# EAGLE design DualDCMotor v1-0 (EAGLE 6.5.0)
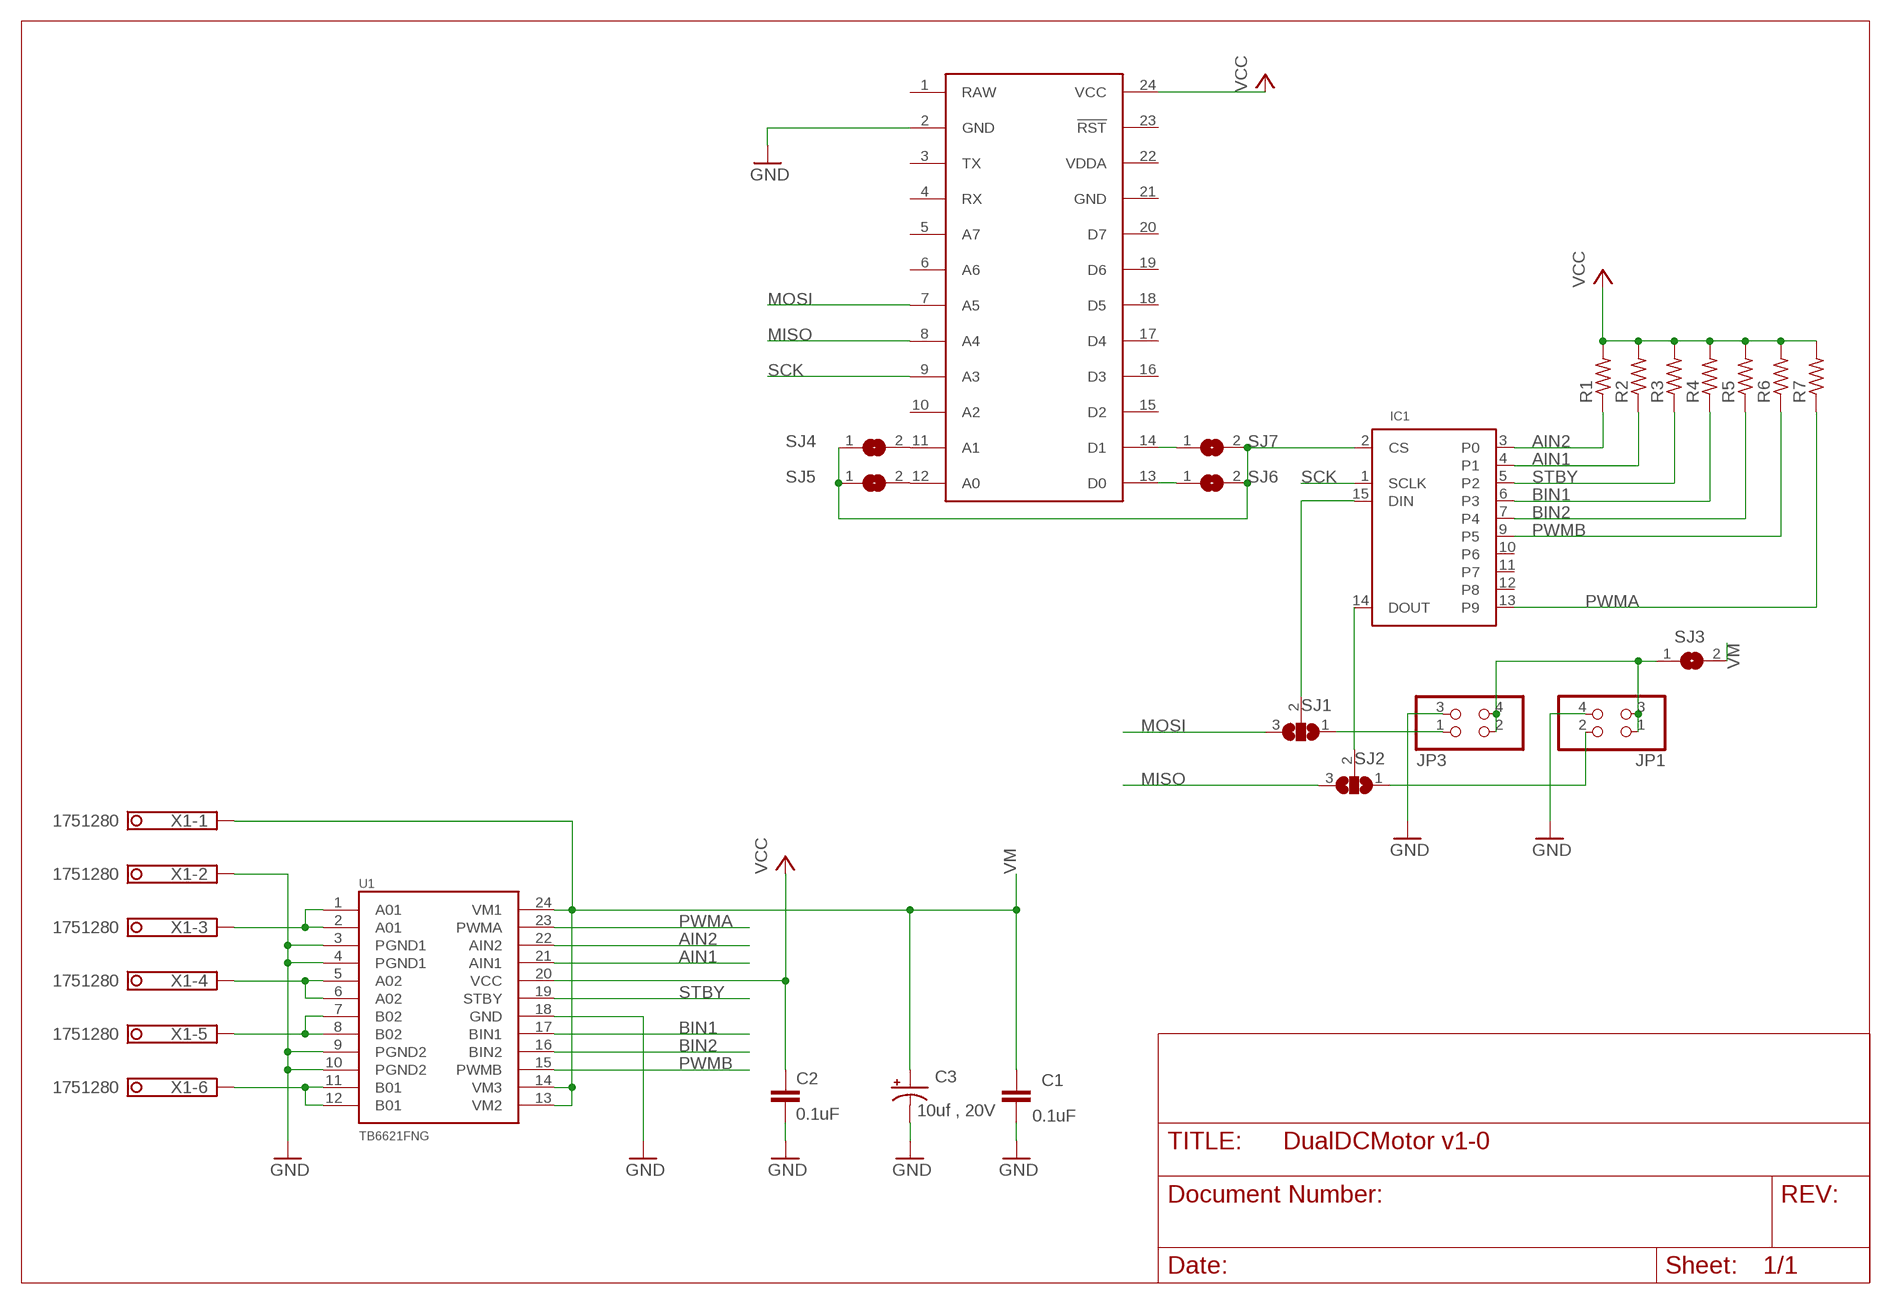
[diagram p0: schematic, sheet 1]

## Parts
C1  0.1uF  CAP0402-CAP  [0402-CAP]
C2  0.1uF  CAP0402-CAP  [0402-CAP]
C3  10uf , 20V  CAP_POL3528  [EIA3528]
IC1  MAX6966AEE  [QSOP16]
JP1  PINHD-2X02_2.54-SMD  [2X02SMD]
JP3  PINHD-2X02_2.54-SMD  [2X02SMD]
R1  R-US_R0603  [R0603]
R2  R-US_R0603  [R0603]
R3  R-US_R0603  [R0603]
R4  R-US_R0603  [R0603]
R5  R-US_R0603  [R0603]
R6  R-US_R0603  [R0603]
R7  R-US_R0603  [R0603]
SJ1  SJ2W  [SJ_2]
SJ2  SJ2W  [SJ_2]
SJ3  SJW  [SJW]
SJ4  SJ  [SJ]
SJ5  SJ  [SJ]
SJ6  SJ  [SJ]
SJ7  SJ  [SJ]
U1  TB6621FNG  [SSOP24]
U$1  SPARK_CORECORE  [SPARK_CORE]
X1  1751280  [1751280]

## Nets
A01: U1.1(A01) U1.2(A01) X1.3
A02: U1.5(A02) U1.6(A02) X1.4
AIN1: IC1.4(P1) R2.1 U1.21(AIN1)
AIN2: IC1.3(P0) R1.1 U1.22(AIN2)
B01: U1.11(B01) U1.12(B01) X1.6
B02: U1.7(B02) U1.8(B02) X1.5
BIN1: IC1.6(P3) R4.1 U1.17(BIN1)
BIN2: IC1.7(P4) R5.1 U1.16(BIN2)
GND: C1.2 C2.2 C3.C(-) JP1.4 JP3.3 U1.3(PGND1) U1.4(PGND1) U1.9(PGND2) U1.10(PGND2) U1.18(GND) U$1.2(GND) X1.2
MISO: SJ2.3 U$1.8(A4)
MOSI: SJ1.3 U$1.7(A5)
N$1: JP3.1 SJ1.1
N$2: JP1.2 SJ2.1
N$3: IC1.15(DIN) SJ1.2
N$4: IC1.14(DOUT) SJ2.2
N$6: SJ4.2 U$1.11(A1)
N$7: SJ5.2 U$1.12(A0)
N$8: SJ6.1 U$1.13(D0)
N$9: SJ7.1 U$1.14(D1)
N$15: IC1.2(CS) SJ4.1 SJ5.1 SJ6.2 SJ7.2
PWMA: IC1.13(P9) R7.1 U1.23(PWMA)
PWMB: IC1.9(P5) R6.1 U1.15(PWMB)
SCK: IC1.1(SCLK) U$1.9(A3)
STBY: IC1.5(P2) R3.1 U1.19(STBY)
VCC: C2.1 R1.2 R2.2 R3.2 R4.2 R5.2 R6.2 R7.2 U1.20(VCC) U$1.24(VCC)
VM: C1.1 C3.A(+) SJ3.2 U1.13(VM2) U1.14(VM3) U1.24(VM1) X1.1
VM2: JP1.1 JP1.3 JP3.2 JP3.4 SJ3.1
Unconnected: IC1.10(P6) IC1.11(P7) IC1.12(P8) U$1.3(TX) U$1.4(RX) U$1.5(A7) U$1.6(A6) U$1.10(A2) U$1.15(D2) U$1.16(D3) U$1.17(D4) U$1.18(D5) U$1.19(D6) U$1.20(D7) U$1.23(!RST)

## Power pins joined to a net without a drawn wire
GND: IC1.8(GND) U$1.21(GND)
RAW: U$1.1(RAW)
VCC: IC1.16(VCC)
VDDA: U$1.22(VDDA)

## Library data of the parts
C1 C2 = SparkFun:CAP: Capacitor Standard 0603 ceramic capacitor, and 0.1" leaded capacitor.
C3 = SparkFun:CAP_POL: Capacitor Polarized These are standard SMD and PTH capacitors. Normally 10uF, 47uF, and 100uF in electrolytic and tantalum varieties. Always verify the external diameter of the through hole cap, it varies with capacity, voltage, and manufacturer. The EIA devices should be standard.
IC1 = max696x:MAX6966AEE
JP1 JP3 = pinhead-2:PINHD-2X02: PIN HEADER
R1-R7 = resistor:R-US_: RESISTOR, American symbol
SJ1 SJ2 = jumper:SJ2W: SMD solder JUMPER
SJ3-SJ7 = jumper:SJ: SMD solder JUMPER
U1 = SparkFun:TB6621FNG: Toshiba 1A motor driver
U$1 = Spark:SPARK_CORE
X1 = con-phoenix-350:1751280: MKDS 1/ 6-3,5 Printklemme Nennstrom: 10 A Bemessungsspannung: 160 V Raster: 3,5 mm Polzahl: 6 Montageart: Löten Anschlussart: Schraubanschluss Anschlussrichtung vom Leiter zur Platine: 0° Source: http://eshop.phoenixcontact.com .. 1751280.pdf; MPN: 1751280; OC_FARNELL: unknown; OC_NEWARK: 27R1765

## Board
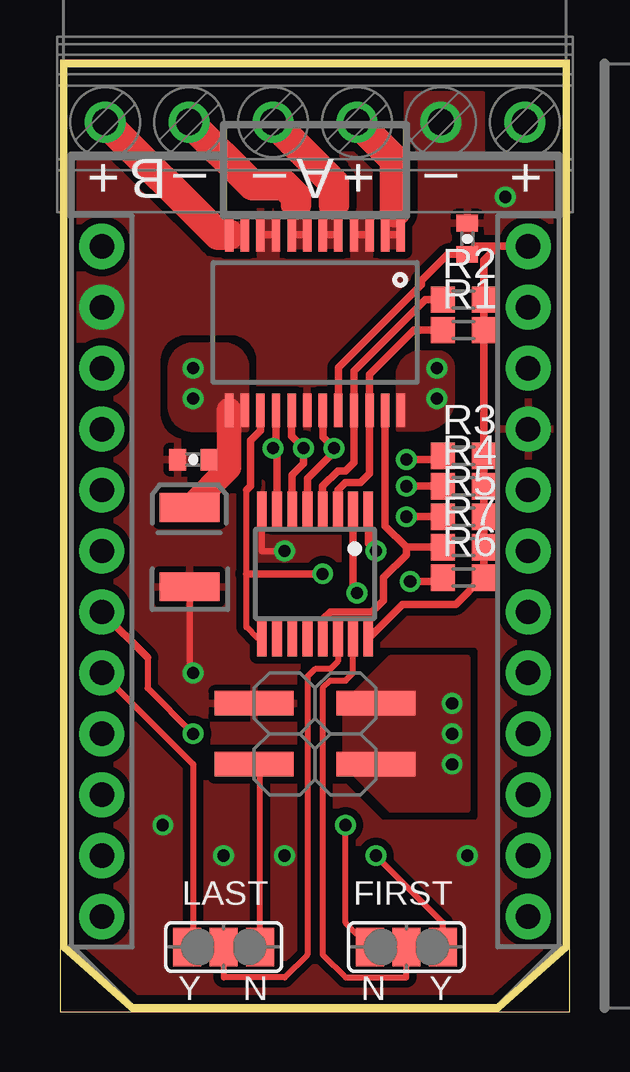
[diagram p1: board, top side]
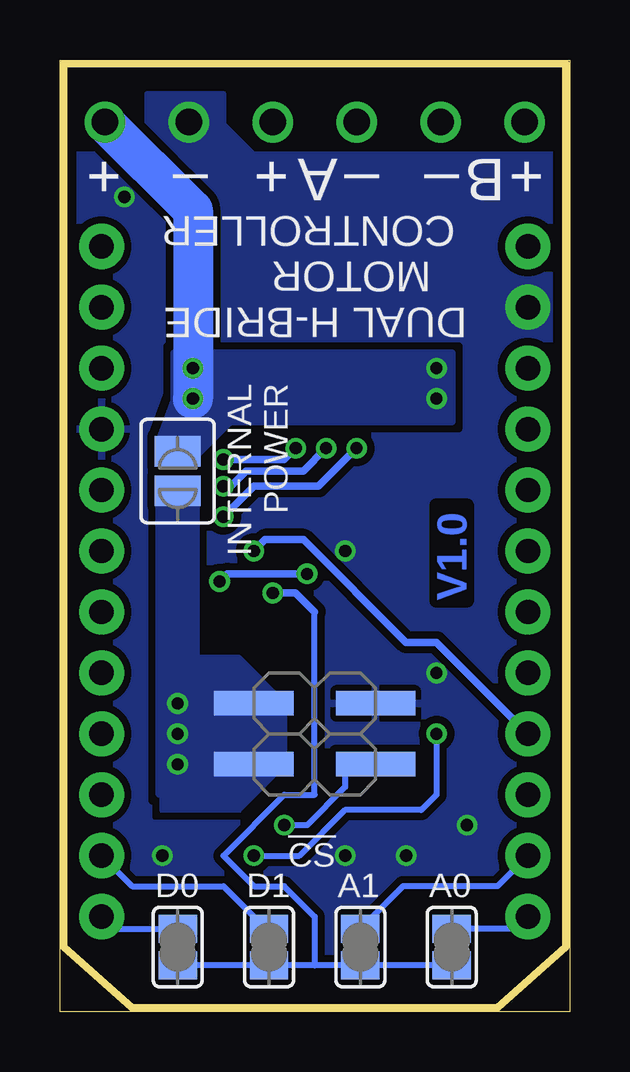
[diagram p2: board, bottom side, seen from below]

Size 21.26 x 39.68 mm. Coordinates in mm from the lower left corner, seen from the top.
Outline: 0,0 21.26,0 21.26,39.68 0,39.68 0,0
Outline: 0.16,39.53 21.11,39.53 21.11,2.7 18.26,0.16 3.02,0.16 0.16,2.7 0.16,39.53
Copper layers (1*16): Top 0.0356mm / dielectric 1.5011mm / Bottom 0.0356mm
Design rules "LaenPCBOrder *": minimum track width 6mil, minimum drill 13mil, track to track 6mil, track to pad 6mil, pad to pad 6mil, via to via 6mil, smd to smd 6mil, copper to edge 15mil, drill to drill 6mil, minimum pad ring 7mil, minimum via ring 7mil, stop-mask expansion 3mil, vias tented up to drill 21mil, thermal gap 10mil

### Footprints (pad centres in the part's own frame; a part is rotated, then mirrored left to right if it is on the bottom)
0402-CAP = smd 0.7 x 0.9: 1 -0.65,0; 2 0.65,0
EIA3528 = smd 1.2 x 2.5: A 1.65,0; C -1.65,0
QSOP16 = smd 0.406 x 1.5: 1 -2.223,-2.69; 2 -1.587,-2.69; 3 -0.953,-2.69; 4 -0.318,-2.69; 5 0.318,-2.69; 6 0.953,-2.69; 7 1.587,-2.69; 8 2.223,-2.69; 9 2.223,2.69; 10 1.587,2.69; 11 0.953,2.69; 12 0.318,2.69; 13 -0.318,2.69; 14 -0.953,2.69; 15 -1.587,2.69; 16 -2.223,2.69
2X02SMD = smd 1.016 x 3.302: 1 -1.27,-3.81; 2 -1.27,1.27; 3 1.27,-3.81; 4 1.27,1.27
R0603 = smd 1 x 1.1: 1 -0.85,0; 2 0.85,0
SJ_2 = smd 1.168 x 1.6: 1 -1.524,0; 2 0,0; 3 1.524,0
SJW = smd 1.27 x 1.905: 1 -0.826,0; 2 0.826,0
SJ = smd 1.168 x 1.6: 1 -0.762,0; 2 0.762,0
SSOP24 = smd 0.348 x 1.397: 1 -3.575,-3.656; 2 -2.925,-3.656; 3 -2.275,-3.656; 4 -1.625,-3.656; 5 -0.975,-3.656; 6 -0.325,-3.656; 7 0.325,-3.656; 8 0.975,-3.656; 9 1.625,-3.656; 10 2.275,-3.656; 11 2.925,-3.656; 12 3.575,-3.656; 13 3.575,3.656; 14 2.925,3.656; 15 2.275,3.656; 16 1.625,3.656; 17 0.975,3.656; 18 0.325,3.656; 19 -0.325,3.656; 20 -0.975,3.656; 21 -1.625,3.656; 22 -2.275,3.656; 23 -2.925,3.656; 24 -3.575,3.656
SPARK_CORE = drill 1.016 pad 1.88: 1 -8.89,13.97; 2 -8.89,11.43; 3 -8.89,8.89; 4 -8.89,6.35; 5 -8.89,3.81; 6 -8.89,1.27; 7 -8.89,-1.27; 8 -8.89,-3.81; 9 -8.89,-6.35; 10 -8.89,-8.89; 11 -8.89,-11.43; 12 -8.89,-13.97; 13 8.89,-13.97; 14 8.89,-11.43; 15 8.89,-8.89; 16 8.89,-6.35; 17 8.89,-3.81; 18 8.89,-1.27; 19 8.89,1.27; 20 8.89,3.81; 21 8.89,6.35; 22 8.89,8.89; 23 8.89,11.43; 24 8.89,13.97
1751280 = drill 1.1 pad 1.7: 1 -8.75,-0.1; 2 -5.25,-0.1; 3 -1.75,-0.1; 4 1.75,-0.1; 5 5.25,-0.1; 6 8.75,-0.1

### Placement (x,y rotation side)
C1  5.56,23.02 180 top
C2  16.99,32.23 90 top
C3  5.4,19.37 90 top
IC1  10.64,18.26 180 top
JP1  9.37,11.59 90 top
JP3  11.91,11.59 90 bottom
R1  16.83,28.42 0 top
R2  16.83,29.69 0 top
R3  16.83,23.18 0 top
R4  16.83,21.91 0 top
R5  16.83,20.64 0 top
R6  16.83,18.1 0 top
R7  16.83,19.37 0 top
SJ1  14.45,2.7 0 top
SJ2  6.83,2.7 180 top
SJ3  16.35,22.54 90 bottom
SJ4  8.73,2.7 90 bottom
SJ5  4.92,2.7 90 bottom
SJ6  16.35,2.7 270 bottom
SJ7  12.54,2.7 270 bottom
U1  10.64,28.73 180 top
U$1  10.64,17.94 0 top
X1  10.64,36.99 180 top

### Tracks (layer width: path | path; a pad name or v marks a point on that pad's centre or on a via)
A01
  Top 0.305: U1.2 U1.1
  Top 1.27: X1.3 13.97,35.51 13.97,33.34
  pour Top (isolate 0.305, no thermals): 13.65,31.91 14.13,31.91 14.13,35.08 13.65,35.08
A02
  Top 0.305: U1.6 U1.5
  Top 1.27: X1.4 11.43,34.55 11.43,33.66
  pour Top (isolate 0.305, no thermals): 11.59,31.91 10.95,31.91 10.95,35.08 11.59,35.08
AIN1
  Top 0.305: IC1.4 10.95,21.91 11.59,22.54 11.91,22.54 12.26,22.9 U1.21 12.26,26.71 15.24,29.69 R2.1
AIN2
  Top 0.305: IC1.3 11.59,21.75 11.91,22.07 12.54,22.07 12.91,22.44 U1.22 12.91,26.56 14.76,28.42 R1.1
B01
  Top 0.305: U1.12 U1.11
  Top 1.27: X1.6 6.58,32.39 U1.12
  pour Top (isolate 0.305, no thermals): 5.71,32.86 7.62,32.86 7.62,31.91 6.51,31.91
B02
  Top 0.305: U1.8 U1.7
  Top 1.27: X1.5 8.03,34.45 9.37,34.45 9.84,33.97 9.84,33.66
  pour Top (isolate 0.305, no thermals): 9.68,31.91 10.32,31.91 10.32,33.97 9.68,33.97
BIN1  (via drill 0.51)
  Top 0.305: 9.66,20.65 IC1.6 9.68,22.38 10.16,22.86 v10.16,23.5 9.66,23.99 U1.17 | R4.1 v14.45,21.91
  Bottom 0.305: v10.16,23.5 11.11,22.54 13.49,22.54 14.13,21.91 v14.45,21.91
BIN2  (via drill 0.51)
  Top 0.305: 9.01,20.67 IC1.7 9.05,23.34 v8.89,23.5 9.01,23.62 U1.16 | R5.1 v14.45,20.64
  Bottom 0.305: v8.89,23.5 10.48,21.91 13.18,21.91 v14.45,20.64
GND  (via drill 0.51)
  Top 0.254: IC1.8 8.41,19.21 v9.37,19.21 | C3.C 5.4,14.29 v5.56,14.13
  Top 0.305: U1.10 U1.9 | U1.4 U1.3
  other vias: 4.29,7.78 16.99,6.51 6.83,6.51 9.37,6.51 18.57,33.97
  pour Bottom (isolate 0.305, rank 2): 0.48,35.72 20.8,35.72 20.8,0.16 0.48,0.16
  pour Top (isolate 0.305, rank 3): 0.48,35.72 20.8,35.72 20.8,0.16 0.48,0.16
  pour Top (isolate 0.305, no thermals): 8.41,33.02 8.89,33.02 8.89,31.43 8.41,31.43
  pour Top (isolate 0.305, no thermals): 12.38,33.02 12.86,33.02 12.86,31.27 12.38,31.27
  pour Top (isolate 0.305, rank 3, no thermals): 17.62,34.45 17.62,38.26 14.45,38.26 14.45,34.45
  pour Bottom (isolate 0.305, no thermals): 3.02,30.64 0.48,30.64 0.48,28.1 3.02,28.1
  pour Top (isolate 0.305, no thermals): 3.02,30.64 0.48,30.64 0.48,28.1 3.02,28.1
  pour Bottom (isolate 0.305, no thermals): 13.18,35.72 14.45,36.99 14.45,38.26 17.62,38.26 17.62,36.99 16.35,35.72
MISO
  Top 0.254: U$1.8 5.56,10.32 5.56,2.95 SJ2.3
MOSI  (via drill 0.51)
  Top 0.254: SJ1.3 15.97,3.71 v13.18,6.51 | 3.65,14.76 3.65,13.49 v5.56,11.59
  Top 0.305: U$1.7 3.65,14.76
  Bottom 0.254: v5.56,11.59 5.56,9.05 6.19,8.41 9.37,8.41 11.27,6.51 v13.18,6.51
N$1  (via drill 0.51)
  Top 0.254: SJ1.1 11.91,3.71 v11.91,7.78
  Bottom 0.254: JP3.1 9.37,10.32 9.37,9.37 10.95,7.78 v11.91,7.78
N$2
  Top 0.254: SJ2.1 8.35,10.06
  Top 0.305: 8.35,10.06 JP1.2
N$3
  Top 0.254: SJ1.2 14.45,1.43 11.91,1.43 10.95,2.38 10.95,13.49 11.27,13.81 11.91,13.81 12.22,14.13 IC1.15
N$4
  Top 0.254: SJ2.2 6.83,1.43 9.37,1.43 10.32,2.38 10.32,13.97 10.64,14.29 11.27,14.29 11.59,14.61 IC1.14
N$6
  Bottom 0.254: U$1.11 3.02,5.24 6.95,5.24 SJ4.2
N$7
  Bottom 0.254: U$1.12 2.25,3.46 SJ5.2
N$8
  Bottom 0.254: U$1.13 19.02,3.46 SJ6.1
N$9
  Bottom 0.254: U$1.14 18.26,5.24 14.45,5.24 12.67,3.46 SJ7.1
N$15  (via drill 0.51)
  Top 0.305: v12.38,17.46 12.22,17.62 IC1.2
  Bottom 0.254: SJ5.1 SJ4.1 10.64,1.94 | 10.64,1.94 SJ7.2 SJ6.2 | 10.64,1.94 10.64,3.97 11.91,5.24 13.18,5.24 14.45,6.51 11.91,9.05 10.64,9.05 10.64,16.67
  Bottom 0.305: 10.64,16.67 11.43,17.46 v12.38,17.46
PWMA
  Top 0.305: U1.23 13.56,20.25 14.45,19.37 | 14.45,19.37 R7.1 | IC1.13 10.95,16.35 11.27,16.67 13.02,16.67 13.49,17.14 13.49,18.1 14.45,19.05 14.45,19.37
PWMB  (via drill 0.51)
  Top 0.254: IC1.9 8.25,15.57 7.78,16.03 7.78,18.26 7.78,21.75
  Top 0.305: U1.15 8.36,24.24 7.94,23.81 7.94,21.91 7.78,21.75 | R6.1 15.82,17.94 v14.61,17.94 | v10.95,18.26 7.78,18.26
  Bottom 0.305: v14.61,17.94 14.29,18.26 v10.95,18.26
SCK  (via drill 0.51)
  Top 0.305: v13.18,19.21 12.86,19.53 IC1.1
  Bottom 0.305: U$1.9 5.56,15.4 6.83,15.4 11.11,19.68 12.7,19.68 v13.18,19.21
STBY  (via drill 0.51)
  Top 0.305: IC1.5 10.32,22.23 11.43,23.34 v11.43,23.5 10.96,23.96 U1.19 | R3.1 15.82,23.02 v14.45,23.02
  Bottom 0.305: v14.45,23.02 11.91,23.02 v11.43,23.5
VCC
  Top 0.305: U1.20 11.61,26.85 15.08,30.32 15.08,30.48 16.18,31.58 C2.1 17.32,31.91 18.26,31.91 | IC1.16 14.28,16.99 16.51,16.99 17.62,18.1 R6.2 R7.2 R5.2 R4.2 R3.2 R1.2 R2.2 17.68,30.96 | 17.68,30.96 17.68,31.33 18.26,31.91 | 18.26,31.91 U$1.24 | 17.66,30.94 17.68,30.96
VM  (via drill 0.51)
  Top 0.254: C1.1 7.06,23.02
  Top 0.305: U1.13 U1.14
  Top 1.016: C3.A 7.06,22.68 7.06,23.02 U1.13
  Bottom 1.676: v15.72,25.56 15.72,33.42 X1.1
  other vias: 5.56,26.83 5.56,25.56 15.72,26.83
  pour Top (no thermals): 4.6,26.83 4.6,25.24 arc90 5.56,24.29 7.78,24.29 7.78,26.83 arc90 6.83,27.78 5.56,27.78 arc90
  pour Top (no thermals): 16.35,25.56 arc-90 15.08,24.29 14.13,24.29 14.13,26.51 arc-90 15.08,27.46 15.72,27.46 arc-90 16.35,26.83
  pour Bottom (no thermals): 4.92,24.61 16.51,24.61 16.51,27.46 4.92,27.46
  pour Bottom (isolate 0.305, no thermals): 17.14,23.81 15.72,23.02 13.18,25.56 16.51,25.56
VM2  (via drill 0.51)
  other vias: 16.35,12.86 16.35,11.59 16.35,10.32
  pour Bottom (no thermals): 11.91,12.86 11.91,10.32 13.81,8.41 16.99,8.41 16.99,14.76 13.81,14.76
  pour Top (no thermals): 11.91,12.86 13.81,14.76 16.99,14.76 16.99,8.41 13.81,8.41 11.91,10.32
  pour Bottom (no thermals): 15.56,22.23 15.56,13.02 15.4,12.7 15.4,9.05 17.14,9.05 17.14,22.23

### Text on the board
Bottom: V1.0
tPlace: B | A | _ | _ | _ | + | + | + | LAST | FIRST | Y | N | N | Y
bPlace: B | A | _ | _ | _ | + | + | + | DUAL H-BRIDE / MOTOR / CONTROLLER | INTERNAL / POWER | !CS | A0 | A1 | D1 | D0